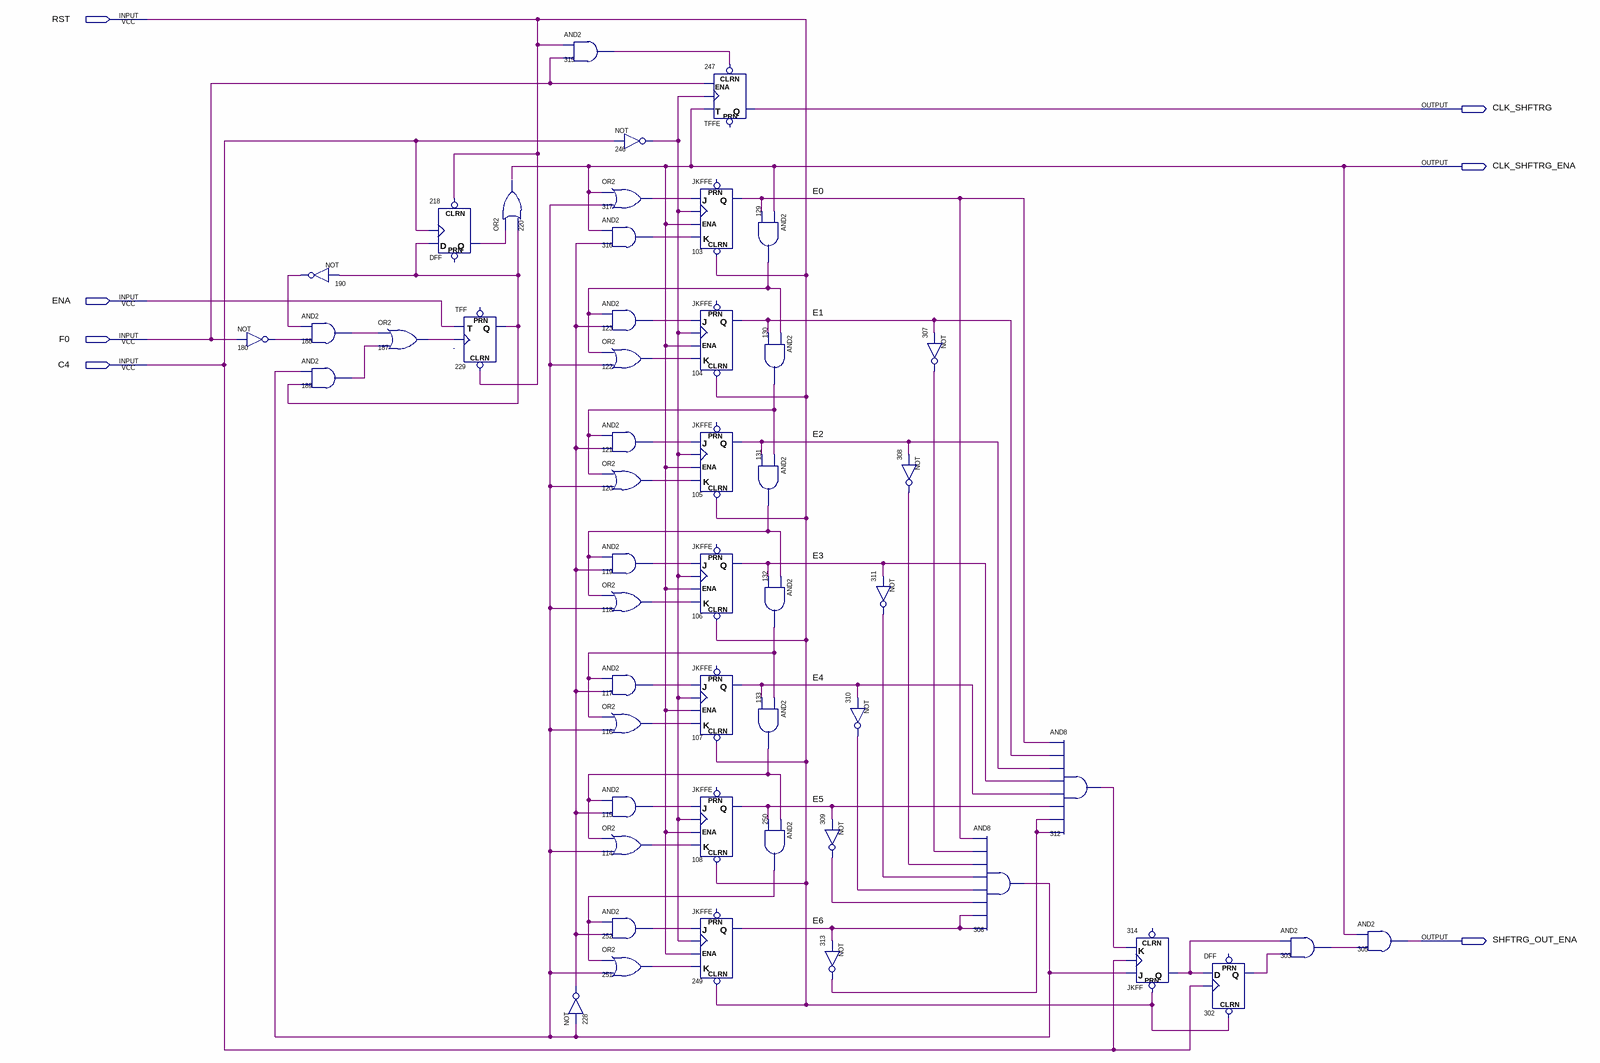
[diagram p0: schematic sheet]
// Quartus schematic shrg_ctrl.bdf as structural Verilog: 51 symbols, 7 pins
module shrg_ctrl (
  input  RST,
  input  ENA,
  input  F0,
  input  C4,
  output CLK_SHFTRG,
  output CLK_SHFTRG_ENA,
  output SHFTRG_OUT_ENA
);

  wire E0, E1, E2, E3, E4, E5, E6, n114_out, n115_out, n116_out, n117_out, n118_out, n119_out, n120_out,
       n121_out, n122_out, n123_out, n129_out, n130_out, n131_out, n132_out, n133_out, n180_out, n187_out,
       n188_out, n189_out, n190_out, n218_q, n228_out, n229_q, n246_out, n250_out, n251_out, n252_out,
       n302_q, n303_out, n306_out, n307_out, n308_out, n309_out, n310_out, n311_out, n312_out, n313_out,
       n314_q, n315_out, n316_out, n317_out;

  not u_180 (n180_out, F0);
  not u_190 (n190_out, n229_q);
  and u_188 (n188_out, n190_out, n180_out);
  and u_189 (n189_out, n306_out, n229_q);
  or u_187 (n187_out, n188_out, n189_out);
  DFF u_218 (.CLRN(RST), .CLK(C4), .D(n229_q), .Q(n218_q));  // open: PRN
  TFF u_229 (.CLRN(RST), .T(ENA), .CLK(n187_out), .Q(n229_q));  // open: PRN
  or u_220 (CLK_SHFTRG_ENA, n218_q, n229_q);
  and u_315 (n315_out, RST, F0);
  not u_228 (n228_out, n306_out);
  not u_246 (n246_out, C4);
  or u_317 (n317_out, CLK_SHFTRG_ENA, n306_out);
  and u_316 (n316_out, CLK_SHFTRG_ENA, n228_out);
  and u_123 (n123_out, n129_out, n228_out);
  or u_122 (n122_out, n129_out, n306_out);
  and u_121 (n121_out, n130_out, n228_out);
  or u_120 (n120_out, n130_out, n306_out);
  and u_119 (n119_out, n131_out, n228_out);
  or u_118 (n118_out, n131_out, n306_out);
  and u_117 (n117_out, n132_out, n228_out);
  or u_116 (n116_out, n132_out, n306_out);
  and u_115 (n115_out, n133_out, n228_out);
  or u_114 (n114_out, n133_out, n306_out);
  and u_252 (n252_out, n250_out, n228_out);
  or u_251 (n251_out, n250_out, n306_out);
  TFFE u_247 (.CLRN(n315_out), .T(CLK_SHFTRG_ENA), .CLK(n246_out), .ENA(F0), .Q(CLK_SHFTRG));  // open: PRN
  JKFFE u_103 (.J(n317_out), .CLK(n246_out), .CLRN(RST), .K(n316_out), .ENA(CLK_SHFTRG_ENA), .Q(E0));  // open: PRN
  JKFFE u_104 (.J(n123_out), .CLK(n246_out), .CLRN(RST), .K(n122_out), .ENA(CLK_SHFTRG_ENA), .Q(E1));  // open: PRN
  JKFFE u_105 (.J(n121_out), .CLK(n246_out), .CLRN(RST), .K(n120_out), .ENA(CLK_SHFTRG_ENA), .Q(E2));  // open: PRN
  JKFFE u_106 (.J(n119_out), .CLK(n246_out), .CLRN(RST), .K(n118_out), .ENA(CLK_SHFTRG_ENA), .Q(E3));  // open: PRN
  JKFFE u_107 (.J(n117_out), .CLK(n246_out), .CLRN(RST), .K(n116_out), .ENA(CLK_SHFTRG_ENA), .Q(E4));  // open: PRN
  JKFFE u_108 (.J(n115_out), .CLK(n246_out), .CLRN(RST), .K(n114_out), .ENA(CLK_SHFTRG_ENA), .Q(E5));  // open: PRN
  JKFFE u_249 (.J(n252_out), .CLK(n246_out), .CLRN(RST), .K(n251_out), .ENA(CLK_SHFTRG_ENA), .Q(E6));  // open: PRN
  and u_129 (n129_out, CLK_SHFTRG_ENA, E0);
  and u_130 (n130_out, n129_out, E1);
  and u_131 (n131_out, n130_out, E2);
  and u_132 (n132_out, n131_out, E3);
  and u_133 (n133_out, n132_out, E4);
  and u_250 (n250_out, n133_out, E5);
  not u_309 (n309_out, E5);
  not u_313 (n313_out, E6);
  not u_311 (n311_out, E3);
  not u_310 (n310_out, E4);
  not u_307 (n307_out, E1);
  not u_308 (n308_out, E2);
  and u_306 (n306_out, E0, n307_out, n308_out, n311_out, n310_out, n309_out, E6, E6);
  and u_312 (n312_out, E0, E1, E2, E3, E4, E5, n313_out, n313_out);
  JKFF u_314 (.PRN(RST), .K(n312_out), .J(n306_out), .CLK(C4), .Q(n314_q));  // open: CLRN
  DFF u_302 (.CLRN(RST), .CLK(C4), .D(n314_q), .Q(n302_q));  // open: PRN
  and u_303 (n303_out, n314_q, n302_q);
  and u_305 (SHFTRG_OUT_ENA, CLK_SHFTRG_ENA, n303_out);
endmodule
